# EAGLE design 12v+:- PSU (EAGLE 9.3.0)
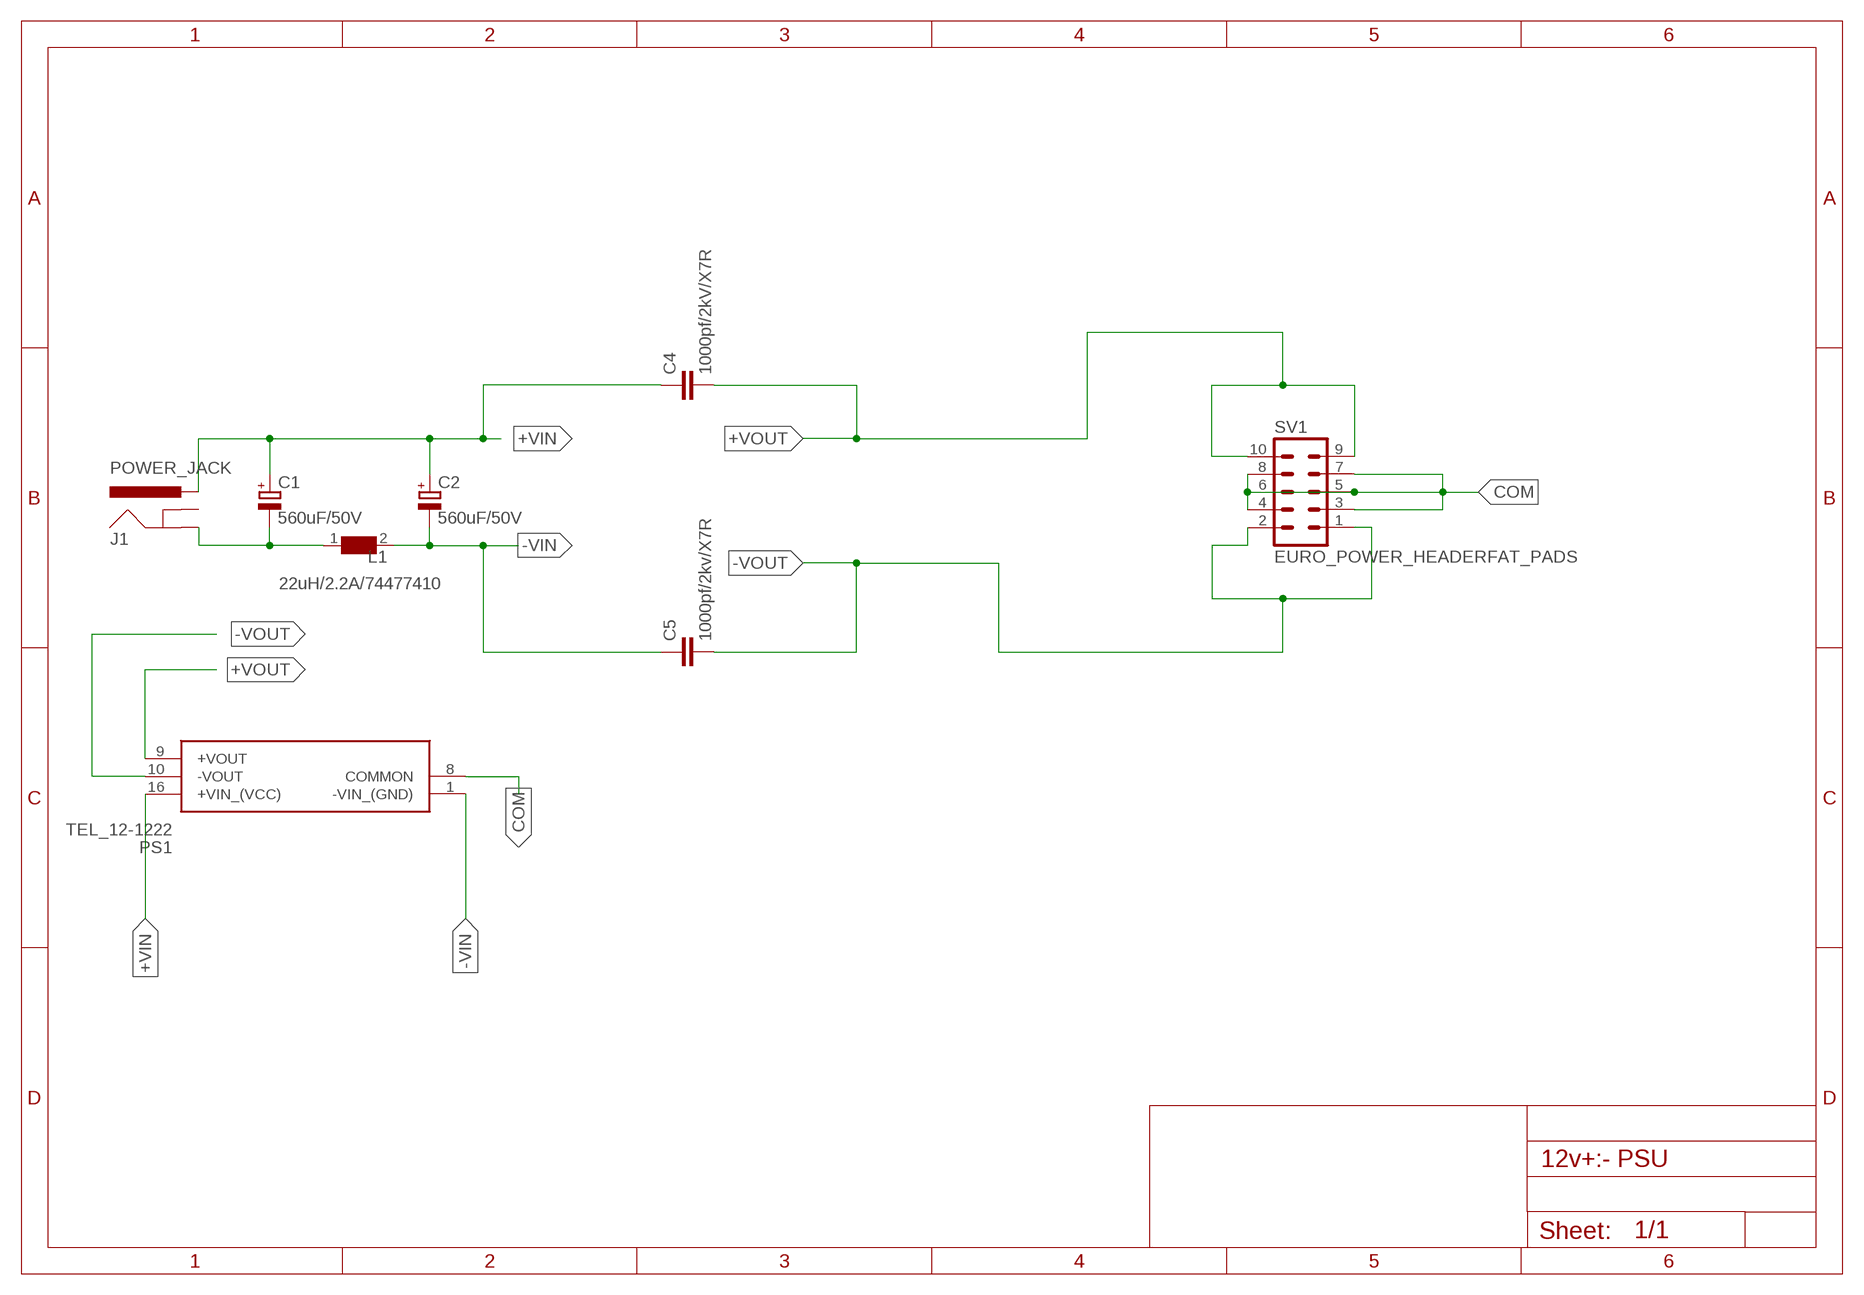
[diagram p0: schematic, sheet 1]

## Parts
C1  560uF/50V  CPOL-EUE7.5-16  [E7,5-16]
C2  560uF/50V  CPOL-EUE7.5-16  [E7,5-16]
C4  1000pf/2kV/X7R  C-EUC0805  [C0805]
C5  1000pf/2kv/X7R  C-EUC0805  [C0805]
J1  POWER_JACK  [POWER_JACK_PTH]
L1  22uH/2.2A/74477410  WE-PD2-74477410_5848/5820  [WE-PD2_5848/5820]
PS1  TEL_12-1222  [TEL121222]
SV1  EURO_POWER_HEADERFAT_PADS  [EURO_PWR_HEADER_FAT]

## Nets
+VIN: C1.+ C2.+ C4.1 J1.PWR PS1.16(+VIN_(VCC))
+VOUT: C4.2 PS1.9(+VOUT) SV1.9 SV1.10
-VIN: C2.- C5.1 L1.2 PS1.1(-VIN_(GND))
-VOUT: C5.2 PS1.10(-VOUT) SV1.1 SV1.2
COM: PS1.8(COMMON) SV1.3 SV1.4 SV1.5 SV1.6 SV1.7 SV1.8
N$2: C1.- J1.GND L1.1
Unconnected: J1.GNDBREAK

## Library data of the parts
C1 C2 = rcl:CPOL-EU: POLARIZED CAPACITOR, European symbol; SPICEPREFIX: C
C4 C5 = rcl:C-EU: CAPACITOR, European symbol; SPICEPREFIX: C
J1 = SparkFun-Connectors:POWER_JACK: Power Jack Connector This is the standard 5.5mm barrel jack for power. The PTH is the most common, proven, reliable, footprint. The Slot footprint only works if the mill layer is transmitted to the PCB fab house so be warned. Here are the connectors we sell at SparkFun: DC Barrel Power Jack/Connector <https://www.sparkfun.com/products/119> (PRT-00119) DC Barrel Power Jack/Connector (SMD) <https://www.sparkfun.com/products/12748> (PRT-12748) DC Barrel Jack Adapter - Breadboard Compatible <https://www.sparkfun.com/products/10811> (PRT-10811) It is used on this SparkFun product (and many, many others): SparkFun RedBoard - Programmed with Arduino <https://www.sparkfun.com/products/12757> (DEV-12757) Also, if you need a mating power supply or connector, please check these out: Wall Adapter Power Supply - 9VDC 650mA <https://www.sparkfun.com/products/298> (TOL-00298) DC Barrel Jack Adapter - Male <https://www.sparkfun.com/products/10287> (PRT-10287); PROD_ID: CONN-08197
L1 = WE-PD2:WE-PD2: SMD-Power Inductors WE-PD2 - Industry standard size - Current capability up to 14 A -- Switching regulators with low operating voltages (computer, laptop, mobile phones, pagers) -- Integrated DC/DC-converter -- Is recommended for the application with switching regulators from National Semiconductor, Linear Technology, Texas Instruments and Fairchild Semiconductor -- Perfectly suitable for switching regulators with extremely high efficiency; MPN: 74477410; OC_FARNELL: 1636014; OC_NEWARK: 08P2817; PACKAGE: 5848; SUPPLIER: Wuerth Elektronik
PS1 = MusicThingModular:TEL_12-1222: 12 Watt DC/DC converter, industrial, 2:1 input, ultra compact design, encapsulated, DIP-16 metal package Source: Datasheet <https://tracopower.com/tel12-datasheet/>; DESCRIPTION: 12 Watt DC/DC converter, industrial, 2:1 input, ultra compact design, encapsulated, DIP-16 metal package; HEIGHT: 10.45mm; MANUFACTURER_NAME: Traco Power; MANUFACTURER_PART_NUMBER: TEL 12-1222; MOUSER_PART_NUMBER: 495-TEL12-1222; MOUSER_PRICE-STOCK: https://www.mouser.co.uk/ProductDetail/TRACO-Power/TEL-12-1222?qs=hd1VzrDQEGiVJ55EfrLu8Q%3D%3D
SV1 = MusicThingModular:EURO_POWER_HEADER: Power Header 10 pin power header for Eurorack Power Supplies Variants with fatter pads for easier soldering, and the LOCK variant which has 5mil offset pins to hold the component in place before soldering

## Board
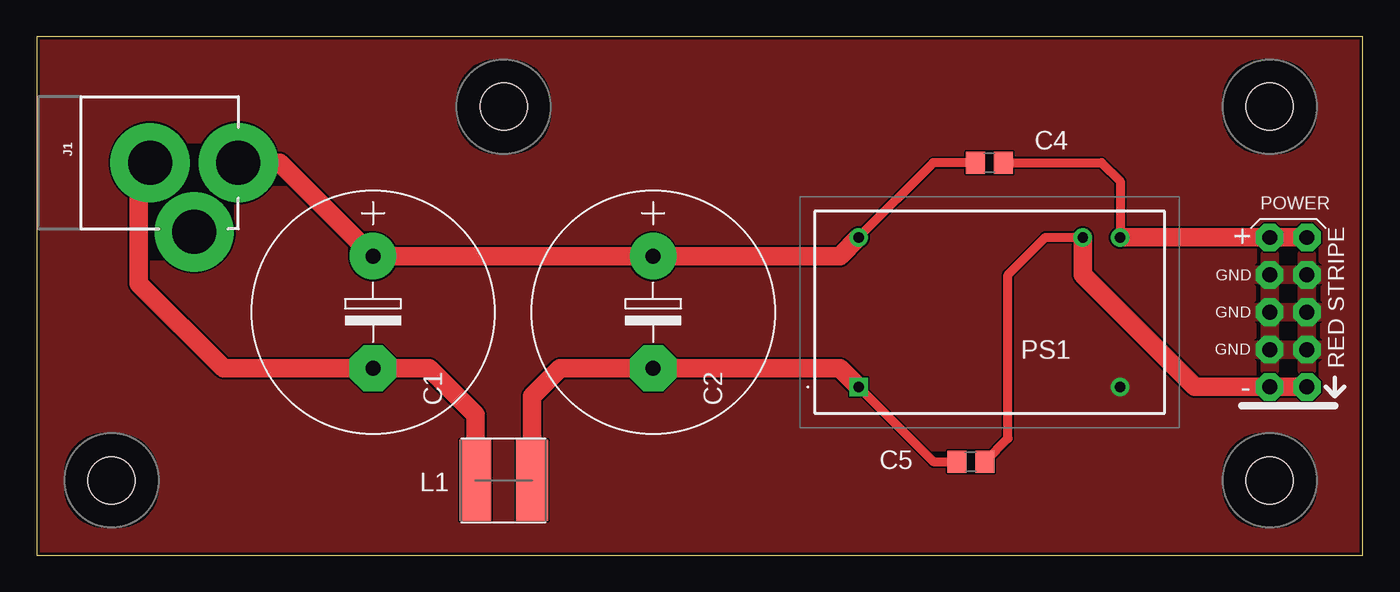
[diagram p1: board, top side]

Size 90.15 x 35.23 mm. Coordinates in mm from the lower left corner, seen from the top.
Outline: 0,0 90.15,0 90.15,35.23 0,35.23 0,0
Copper layers (1*16): Top 0.035mm / dielectric 1.6mm / Bottom 0.035mm
Design rules "jlcpcb-2layers": minimum track width 5mil, minimum drill 0.3mm, track to track 5mil, track to pad 5mil, pad to pad 5mil, via to via 5mil, smd to smd 5mil, copper to edge 0.2mm, drill to drill 6mil, minimum pad ring 10mil, minimum via ring 3mil, stop-mask expansion 4mil, vias tented up to drill 0mil, thermal gap 10mil

### Footprints (pad centres in the part's own frame; a part is rotated, then mirrored left to right if it is on the bottom)
E7,5-16 = drill 1.016 pad 3.15: + -3.81,0 | drill 1.016 pad 3.15 octagon: - 3.81,0
C0805 = smd 1.3 x 1.5: 1 -0.95,0; 2 0.95,0
POWER_JACK_PTH = drill 2.997 pad 4.318: GND 0,7.7; GNDBREAK 4.7,10.7; PWR 0,13.7
WE-PD2_5848/5820 = smd 2.15 x 5.5: 1 -1.925,0; 2 1.925,0
TEL121222 = drill 0.7 pad 1.2 square: 1 0,0 | drill 0.7 pad 1.2: 8 17.78,0; 9 17.78,10.16; 10 15.24,10.16; 16 0,10.16
EURO_PWR_HEADER_FAT = drill 1.016 pad 1.88 octagon: 1 -5.08,-1.27; 2 -5.08,1.27; 3 -2.54,-1.27; 4 -2.54,1.27; 5 0,-1.27; 6 0,1.27; 7 2.54,-1.27; 8 2.54,1.27; 9 5.08,-1.27; 10 5.08,1.27
MOUNTING_HOLE = hole 3.2: 0,0

### Placement (x,y rotation side)
C1  22.86,16.51 270 top
C2  41.91,16.51 270 top
C4  64.77,26.67 0 top
C5  63.5,6.35 0 top
J1  0,26.67 270 top
L1  31.75,5.08 0 top
PS1  55.88,11.43 0 top
SV1  85.09,16.51 90 top
U$1  [MOUNTING_HOLE]  83.82,30.48 0 top
U$2  [MOUNTING_HOLE]  83.82,5.08 0 top
U$3  [MOUNTING_HOLE]  5.08,5.08 0 top
U$4  [MOUNTING_HOLE]  31.75,30.48 0 top

### Tracks (layer width: path | path; a pad name or v marks a point on that pad's centre or on a via)
+VIN
  Top 0.61: C4.1 60.96,26.67 PS1.16
  Top 1.27: PS1.16 54.61,20.32 C2.+ C1.+ 16.51,26.67 J1.PWR
+VOUT
  Top 0.61: C4.2 72.39,26.67 73.66,25.4 PS1.9
  Top 1.27: PS1.9 SV1.10 SV1.9
-VIN
  Top 0.61: PS1.1 60.96,6.35 C5.1
  Top 1.27: PS1.1 54.61,12.7 C2.- 35.56,12.7 33.67,10.81 L1.2
-VOUT
  Top 0.61: C5.2 66.04,7.94 66.04,19.05 68.58,21.59 PS1.10
  Top 1.27: PS1.10 71.12,19.05 78.74,11.43 SV1.2 SV1.1
COM
  pour Top: 0,35.56 90.17,35.56 90.17,0 0,0
N$2
  Top 1.27: J1.GND 6.94,25.91 6.94,18.46 12.7,12.7 C1.- 26.67,12.7 29.82,9.54 L1.1